# Altium schematic sheet ECGCircuit.SchDoc
size A3; SheetNumber: 4; SheetTotal: 4
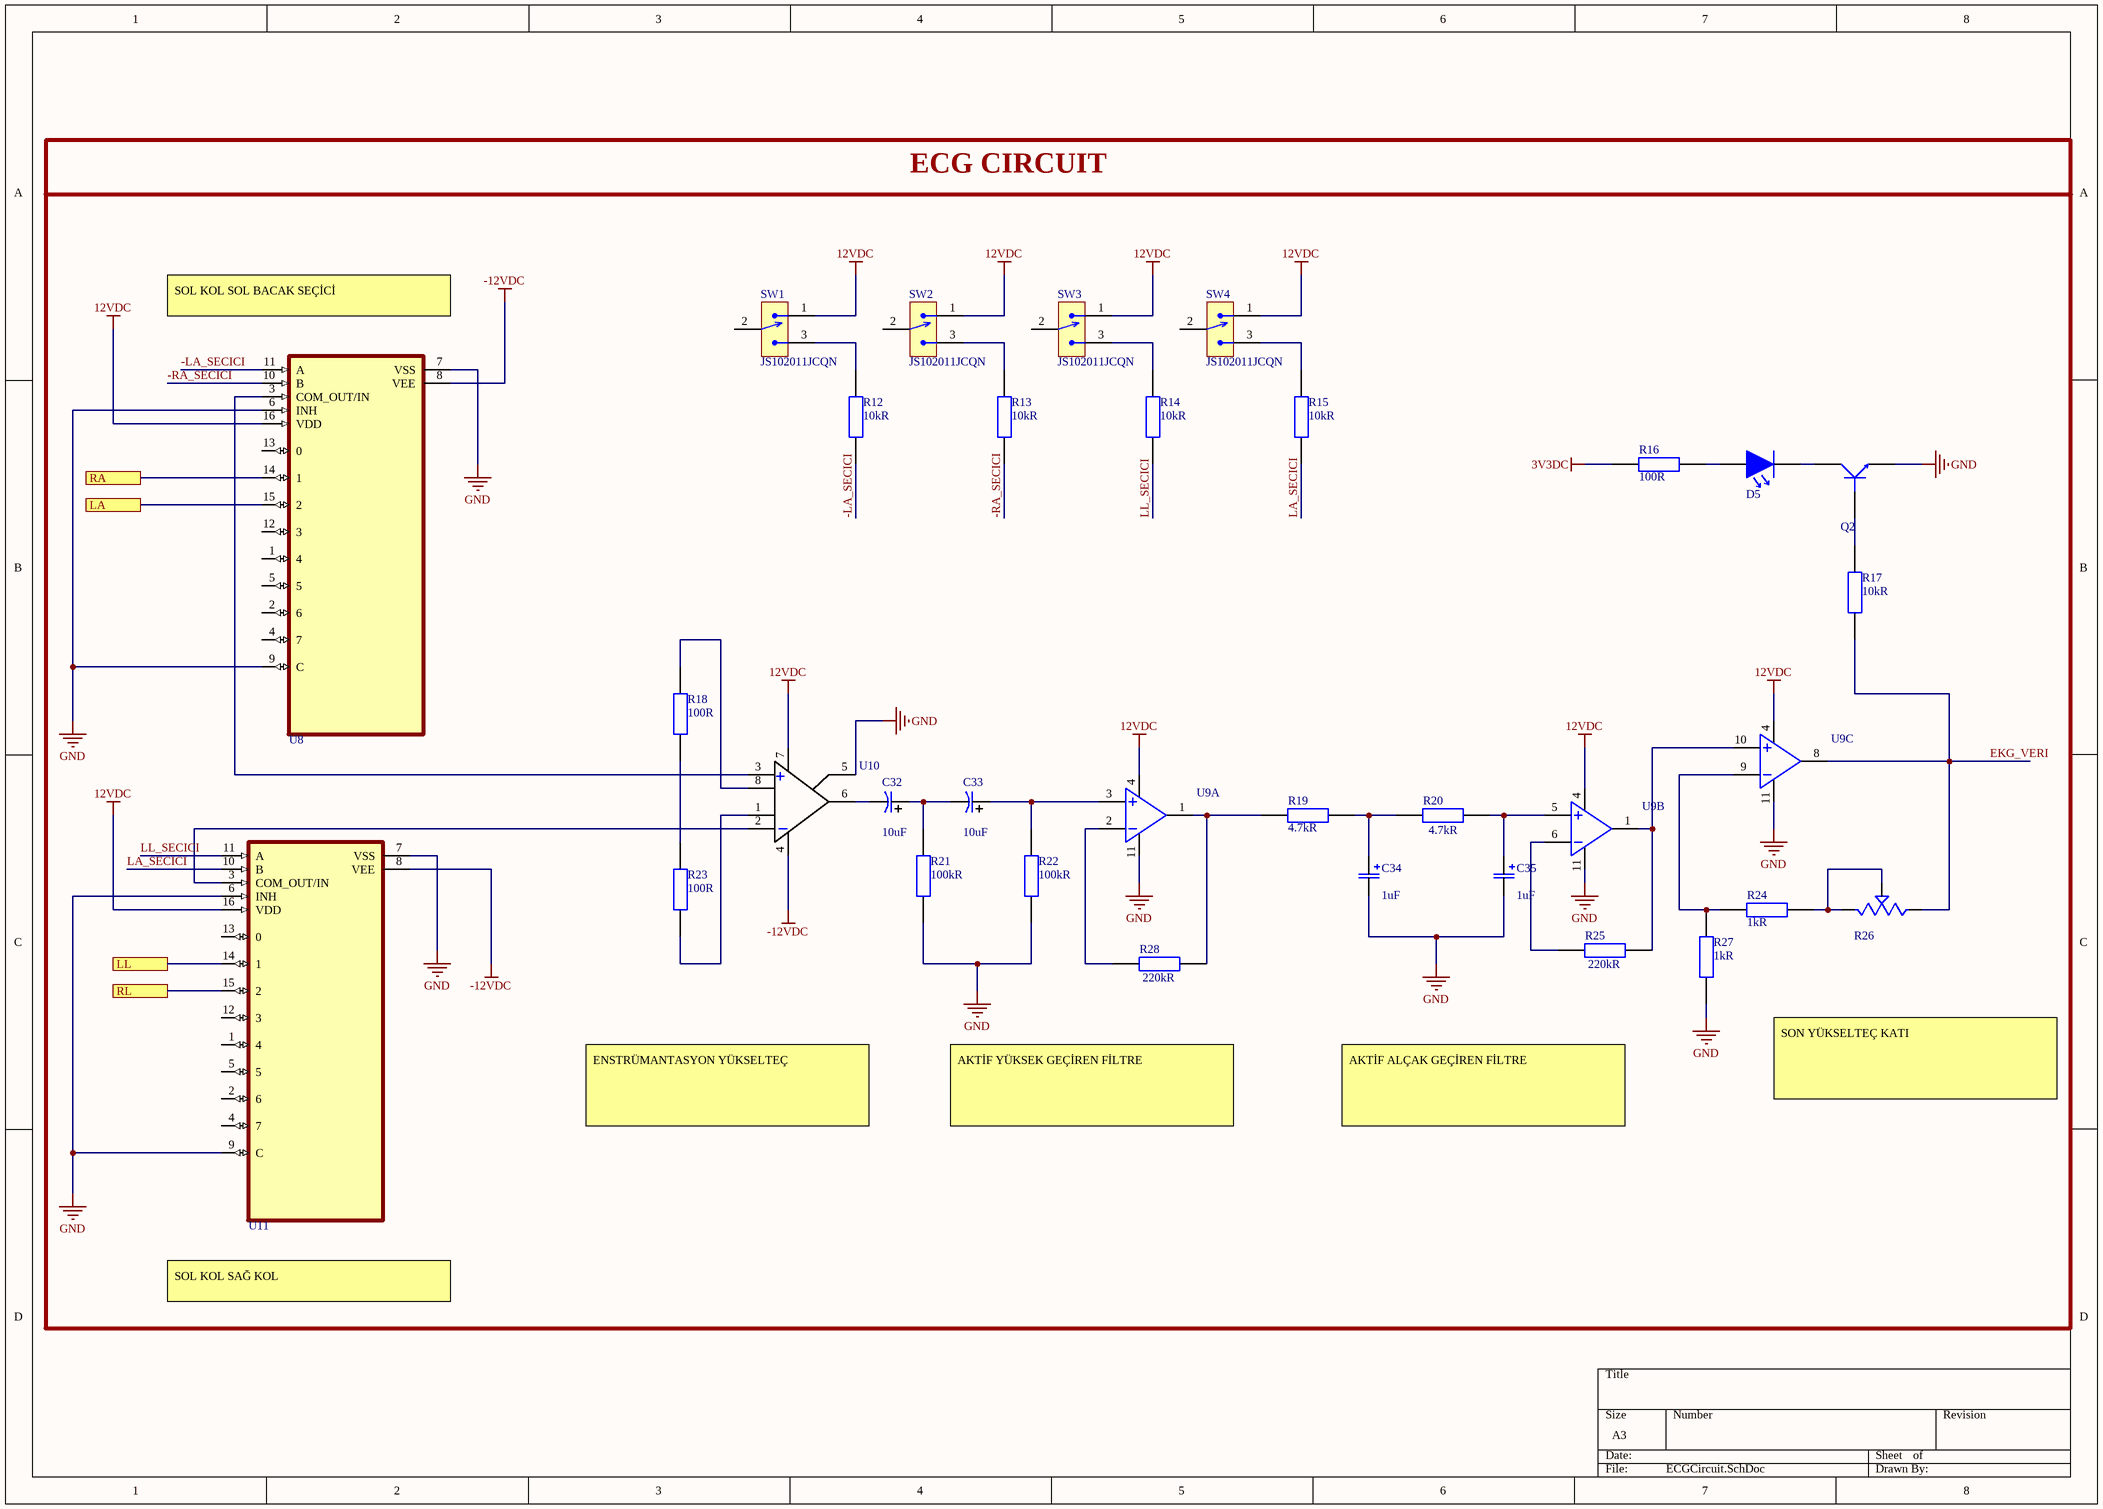
[diagram p0: ECGCircuit.SchDoc]

## Parts
C32  Capacitance: 10uF  [A700V_KEM]  (hidden comment: AP ALU 10uF)
C33  Capacitance: 10uF  [A700V_KEM]  (hidden comment: ALU 10uF)
C34  Capacitance: 1uF  [EXV-9B_KEM]  (hidden comment: CAP ALU 1uF)
C35  Capacitance: 1uF  [EXV-9B_KEM]  (hidden comment: CAP ALU 1uF)
D5  LH R974-LP-1  [LED_RED_0805]  (value not drawn)
Q2  MMBT3904-7-F  [SOT-23F]  (value not drawn)
R12  Resistance: 10kR  [RES_0603]  (hidden comment: RC0603FR-0710KL)
R13  Resistance: 10kR  [RES_0603]  (hidden comment: RC0603FR-0710KL)
R14  Resistance: 10kR  [RES_0603]  (hidden comment: RC0603FR-0710KL)
R15  Resistance: 10kR  [RES_0603]  (hidden comment: RC0603FR-0710KL)
R16  Resistance: 100R  [RES_0603]  (hidden comment: RC0603JR-07100RL)
R17  Resistance: 10kR  [RES_0603]  (hidden comment: RC0603FR-0710KL)
R18  Resistance: 100R  [RES_0603]  (hidden comment: RC0603JR-07100RL)
R19  Resistance: 4.7kR  [RES_0603]  (hidden comment: RC0603JR-074K7L)
R20  Resistance: 4.7kR  [RES_0603]  (hidden comment: RC0603JR-074K7L)
R21  Resistance: 100kR  [RES_0603]  (hidden comment: RES SMD 100KOHM 0.25% 1/10W 0603)
R22  Resistance: 100kR  [RES_0603]  (hidden comment: RES SMD 100KOHM 0.25% 1/10W 0603)
R23  Resistance: 100R  [RES_0603]  (hidden comment: RC0603JR-07100RL)
R24  Resistance: 1kR  [RES_0603]  (hidden comment: RC0603FR-0710KL)
R25  Resistance: 220kR  [RES_0603]  (hidden comment: RC0603JR-07220KL)
R26  TRIMMER, 12 TURN 50K  [3266W-1-503LF]  (value not drawn)
R27  Resistance: 1kR  [RES_0603]  (hidden comment: RC0603FR-0710KL)
R28  Resistance: 220kR  [RES_0603]  (hidden comment: RC0603JR-07220KL)
SW1  JS102011JCQN  [JS102011JCQN]
SW2  JS102011JCQN  [JS102011JCQN]
SW3  JS102011JCQN  [JS102011JCQN]
SW4  JS102011JCQN  [JS102011JCQN]
U8  CD4051BM  [SOİC16]  (value not drawn)
U9  IC OPAMP GP 1.3MHZ 14DIP  [SOIC14]  (value not drawn)  (parts A,B,C of 4)
U10  AD620BRZ-R7  [SOIC8]  (value not drawn)
U11  CD4051BM  [SOİC16]  (value not drawn)

## Blocks framed on the sheet
ECG CIRCUIT: C32-C35 D5 Q2 R12-R28 SW1-SW4 U8-U11

## Ports
LA, LL, RA, RL

## Nets
3V3DC: R16.2
12VDC: SW1.1 SW2.1 SW3.1 SW4.1 U8.16(VDD) U9.4 U10.7 U11.16(VDD)
-12VDC: U8.8(VEE) U10.4 U11.8(VEE)
GND: C34.2 C35.2 Q2.2(E) R21.1 R22.1 R27.1 U8.6(INH) U8.7(VSS) U8.9(C) U9.11 U10.5 U11.6(INH) U11.7(VSS) U11.9(C)
-LA_SECICI: R12.1 U8.11(A)
-RA_SECICI: R13.1 U8.10(B)
EKG_VERI: R17.1 R26.1(CCW) U9.8
LA: U8.15(2) ; port LA
LA_SECICI: R15.1 U11.10(B)
LL: U11.14(1) ; port LL
LL_SECICI: R14.1 U11.11(A)
RA: U8.14(1) ; port RA
RL: U11.15(2) ; port RL
NetC32_1: C32.1 C33.2 R21.2
NetC32_2: C32.2 U10.6
NetC33_1: C33.1 R22.2 U9.3
NetC34_1: C34.1 R19.2 R20.1
NetC35_1: C35.1 R20.2 U9.5
NetD5_1: D5.1 Q2.3(C)
NetD5_2: D5.2 R16.1
NetQ2_1: Q2.1(B) R17.2
NetR12_2: R12.2 SW1.3
NetR13_2: R13.2 SW2.3
NetR14_2: R14.2 SW3.3
NetR15_2: R15.2 SW4.3
NetR18_1: R18.1 R23.2
NetR18_2: R18.2 U10.8
NetR19_1: R19.1 R28.2 U9.1
NetR23_1: R23.1 U10.1
NetR24_1: R24.1 R27.2 U9.9
NetR24_2: R24.2 R26.2(WIPER) R26.3(CW)
NetR25_1: R25.1 U9.6
NetR25_2: R25.2 U9.1 U9.10
NetR28_1: R28.1 U9.2
NetU8_3: U8.3(COM_OUT/IN) U10.3
NetU10_2: U10.2 U11.3(COM_OUT/IN)

Not connected (* = marked no-connect by the designer): SW1 2; SW2 2; SW3 2; SW4 2; U8 1(4) 2(6) 4(7) 5 12(3) 13(0); U11 1(4) 2(6) 4(7) 5 12(3) 13(0)

## Notes on the sheet
- SOL KOL SOL BACAK SEÇİCİ
- ENSTRÜMANTASYON YÜKSELTEÇ
- AKTİF YÜKSEK GEÇİREN FİLTRE
- AKTİF ALÇAK GEÇİREN FİLTRE
- SON YÜKSELTEÇ KATI
- SOL KOL SAĞ KOL

## Library data of the parts
C32 C33 = CAP ALU 10uF: CAP ALUM POLY 10UF 20% 12.5V SMD; Manufacturer: KEMET; Manufacturer Part Number: A700V106M12RATE040; Ripple Current: 2.6A; ESR (Equivalent Series Resistance): 40mR; Resistance: 0.04R; Leakage Current: 70.5uA; Supplier 1: Digi-Key; RoHS: Yes; Category: Polymer Capacitors; Stock 1: 1836; Pricing 1: 1=2,35000, 10=1,89800, 50=1,65600, 100=1,44900, 500=1,10400 (USD); Mount: Surface Mount; Case/Package: 2917; Case Code (Metric): 7343; Case Code (Imperial): 2917; Min Operating Temperature: -55°C; Max Operating Temperature: 125°C; Package Quantity: 1; Voltage Rating: 12.5V; Tolerance: 20%; Packaging: Tape and Reel; Voltage Rating (DC): 12.5V; Termination: SMD/SMT; Series: AO-Cap A700; Length: 7.3mm; Width: 0.169inch; Height: 2mm; Height - Seated (Max): 0.079inch; Depth: 4.3mm; Radiation Hardening: No; RoHS Compliant: Yes; ComponentLink1URL: https://datasheet.ciiva.com/18192/getdatasheetpartid-711731-18192331.pdf?src-supplier=Verical; ComponentLink1Description: https://datasheet.ciiva.com/18192/getdatasheetpartid-711731-18192331.pdf?src-supplier=Verical; Supplier Part Number 1: 399-5293-1-ND
C34 C35 = CAP ALU 1uF: KEMET - EXV105M050A9BAA - CAP, 1µF, 50V, RADIAL, SMD; Tolerance: 20%; Ripple Current: 42mA; Ripple Current (AC): 60mA; Polarity: Polar; Impedance: 5R; Life (Hours): 3000Hour; Supplier 1: Digi-Key; Manufacturer: KEMET; Manufacturer Part Number: EXV105M050A9BAA; RoHS: Yes; Category: Aluminum Electrolytic Capacitors; Stock 1: 8489; Pricing 1: 1=0,41000, 10=0,28400, 50=0,19880, 100=0,17040, 500=0,12782, 1000=0,10794 (USD); Mount: Surface Mount; Case/Package: Radial; Min Operating Temperature: -40°C; Max Operating Temperature: 105°C; Voltage Rating: 50V; Packaging: Cut Tape; Package Quantity: 2000; Voltage Rating (DC): 50V; Series: EXV; Construction: Cylindrical; Diameter: 4mm; Height: 5.4mm; Height - Seated (Max): 0.222inch; REACH SVHC: No SVHC; RoHS Compliant: Yes; ComponentLink1URL: https://datasheet.ciiva.com/8032/1500293-8032447.pdf?src-supplier=Element14; ComponentLink1Description: https://datasheet.ciiva.com/8032/1500293-8032447.pdf?src-supplier=Element14; Supplier Part Number 1: 399-11442-1-ND
D5 = LED RED 0805: LED Uni-Color Hyper Red 660nm 2-Pin Chip 0805(2012Metric) T/R; Manufacturer: Osram Opto; Lens Color: White; Forward Voltage: 1.8V; Lens Style: Diffused,Flat,Colorless; Luminous Intensity: 71mcd; Viewing Angle: 160°; Forward Current: 30mA; Dominant Wavelength: 645nm; Number of Elements: 1; Test Current: 20mA; Reverse Voltage: 5V; Lens Transparency: Diffused; Luminous Flux: 0.17lm; Lens Size: 1.25mm; Designed by: TALAT; Supplier 1: Digi-Key; Manufacturer Part Number: LH R974-LP-1; RoHS: Yes; Category: LEDs; Stock 1: 35632; Pricing 1: 1=0,26000, 10=0,13900, 100=0,06480, 500=0,05978, 1000=0,04683, 2000=0,04584 (USD); Mount: Surface Mount; Case/Package: 0805; Number of Pins: 2; Color: Red; Case Code (Imperial): 0805; Case Code (Metric): 2012; Min Operating Temperature: -30°C; Max Operating Temperature: 85°C; Packaging: Tape and Reel; Illumination Color: Red; Package Quantity: 1; Series: CHipLED; Length: 2.1mm; Width: 1.25mm; Depth: 1.35mm; Radiation Hardening: No; RoHS Compliant: Yes; ComponentLink1URL: http://www.jameco.com/Jameco/Products/ProdDS/2085634.pdf?src-supplier=Jameco; ComponentLink1Description: http://www.jameco.com/Jameco/Products/ProdDS/2085634.pdf?src-supplier=Jameco; ComponentLink2URL: http://components.arrow.com/part/dataview/0323_01825492?src-supplier=Arrow+Europe; ComponentLink2Description: http://components.arrow.com/part/dataview/0323_01825492?src-supplier=Arrow+Europe; ComponentLink3URL: https://dammedia.osram.info/media/resource/hires/osram-dam-2493888/LH%20R974.pdf?src-supplier=Digi-Key; ComponentLink3Description: https://dammedia.osram.info/media/resource/hires/osram-dam-2493888/LH%20R974.pdf?src-supplier=Digi-Key; ComponentLink4URL: http://www.mouser.com/ds/2/311/LH%20R974%20-%20CHIPLED%200805-318659.pdf?src-supplier=Mouser; ComponentLink4Description: http://www.mouser.com/ds/2/311/LH%20R974%20-%20CHIPLED%200805-318659.pdf?src-supplier=Mouser; ComponentLink5URL: https://www.verical.com/server-webapp/html/getDatasheet?partID=258950&src-supplier=Verical; ComponentLink5Description: https://www.verical.com/server-webapp/html/getDatasheet?partID=258950&src-supplier=Verical; ComponentLink6URL: http://components.arrow.com/part/dataview/41971690S1077610N9133?src-supplier=Arrow+Electronics; ComponentLink6Description: http://components.arrow.com/part/dataview/41971690S1077610N9133?src-supplier=Arrow+Electronics; ComponentLink7URL: http://components.arrow.com/part/dataview/41971690S6190115N2128?src-supplier=Arrow+Electronics; ComponentLink7Description: http://components.arrow.com/part/dataview/41971690S6190115N2128?src-supplier=Arrow+Electronics; Supplier Part Number 1: 475-1415-1-ND
Q2 = MMBT3904-7-F: Transistor General Purpose BJT NPN 40 Volt 0.2A Automotive 3-Pin SOT-23; Manufacturer: Diodes Zetex; Designed by: TALAT; Max Power Dissipation: 300mW; Collector Emitter Voltage (VCEO): 40V; Max Collector Current: 200mA; Collector Base Voltage (VCBO): 60V; Frequency: 300MHz; hFE Min: 100; Number of Elements: 1; Emitter Base Voltage (VEBO): 6V; Collector Emitter Saturation Voltage: 300mV; Power Dissipation: 350mW; Element Configuration: Single; Supplier 1: Digi-Key; Manufacturer Part Number: MMBT3904-7-F; RoHS: Yes; Category: BJTs; Stock 1: 2393281; Pricing 1: 1=0,12000, 10=0,08600, 25=0,08280, 100=0,04660, 500=0,03664, 1000=0,02544 (USD); Mount: Surface Mount; Case/Package: SOT-23; Number of Pins: 3; Weight: 0.000282oz; Contact Plating: Tin,Matte; Min Operating Temperature: -55°C; Max Operating Temperature: 150°C; Polarity: NPN; Packaging: Tape and Reel; Package Quantity: 3000; Transition Frequency: 300MHz; Collector Emitter Breakdown Voltage: 40V; Max Breakdown Voltage: 40V; Continuous Collector Current: 200mA; Max Frequency: 300MHz; Gain Bandwidth Product: 300MHz; Series: -; Collector-emitter Voltage-Max: 300mV; Voltage Rating (DC): 40V; Length: 3.05mm; Width: 1.4mm; Height: 1mm; Radiation Hardening: No; REACH SVHC: No SVHC; Lead Free: Lead Free; RoHS Compliant: Yes; ComponentLink1URL: https://datasheet.ciiva.com/11201/ds30036-11201778.pdf?src-supplier=Avnet; ComponentLink1Description: https://datasheet.ciiva.com/11201/ds30036-11201778.pdf?src-supplier=Avnet; ComponentLink2URL: https://datasheet.ciiva.com/15138/getdatasheetpartid-53265-15138780.pdf?src-supplier=Verical; ComponentLink2Description: https://datasheet.ciiva.com/15138/getdatasheetpartid-53265-15138780.pdf?src-supplier=Verical; ComponentLink3URL: https://datasheet.ciiva.com/6361/ds30036-6361254.pdf?src-supplier=Digi-Key; ComponentLink3Description: https://datasheet.ciiva.com/6361/ds30036-6361254.pdf?src-supplier=Digi-Key; ComponentLink4URL: https://datasheet.ciiva.com/22711/1915516-22711750.pdf?src-supplier=Element14; ComponentLink4Description: https://datasheet.ciiva.com/22711/1915516-22711750.pdf?src-supplier=Element14; ComponentLink5URL: https://datasheet.ciiva.com/11198/ds30036-11198999.pdf?src-supplier=Avnet; ComponentLink5Description: https://datasheet.ciiva.com/11198/ds30036-11198999.pdf?src-supplier=Avnet; ComponentLink6URL: https://datasheet.ciiva.com/6361/ds30036-6361256.pdf?src-supplier=Digi-Key; ComponentLink6Description: https://datasheet.ciiva.com/6361/ds30036-6361256.pdf?src-supplier=Digi-Key; Supplier Part Number 1: MMBT3904-FDIDKR-ND
R12-R15 R17 = RES 10K OHM 0603: RES 10K %1 OHM 0603 SMD; Manufacturer: Yageo; Designed by: TALAT; Tolerance: 1%; Temperature Coefficient: 100ppm/°C; Voltage Rating (DC): 50V; Power Rating: 100mW; Voltage Rating: 75V; Supplier 1: Digi-Key; Manufacturer Part Number: RC0603FR-0710KL; RoHS: Yes; Category: Chip SMD Resistors; Stock 1: 28304153; Pricing 1: 1=0,10000, 10=0,02400, 100=0,00970, 1000=0,00436, 2500=0,00378 (USD); Case/Package: 0603; Number of Pins: 2; Case Code (Imperial): 0603; Case Code (Metric): 1608; Weight: 7.1E-05oz; Size Code: 0603; Min Operating Temperature: -55°C; Max Operating Temperature: 155°C; Resistor Type: Thick Film; Packaging: Tape and Reel; Termination: SMD/SMT; Features: Moisture Resistant; Series: RC; Max Power Dissipation: 100mW; Number of Terminations: 2; Resistance Tolerance: 1%; Construction: Rectangular; Length: 1.6mm; Width: 0.8mm; Height: 0.45mm; Depth: 0.8mm; Lead Pitch: 0.3mm; REACH SVHC: Unknown; Lead Free: Lead Free; Military Standard: Not; RoHS Compliant: Yes; ComponentLink1URL: https://datasheet.ciiva.com/7660/38590-7660789.pdf?src-supplier=Element14; ComponentLink1Description: https://datasheet.ciiva.com/7660/38590-7660789.pdf?src-supplier=Element14; ComponentLink2URL: https://datasheet.ciiva.com/7983/443971-7983596.pdf?src-supplier=Element14; ComponentLink2Description: https://datasheet.ciiva.com/7983/443971-7983596.pdf?src-supplier=Element14; ComponentLink3URL: https://datasheet.ciiva.com/22747/443971-22747519.pdf?src-supplier=Element14; ComponentLink3Description: https://datasheet.ciiva.com/22747/443971-22747519.pdf?src-supplier=Element14; ComponentLink4URL: https://datasheet.ciiva.com/46440/1868787-46440891.pdf?src-supplier=Element14; ComponentLink4Description: https://datasheet.ciiva.com/46440/1868787-46440891.pdf?src-supplier=Element14; ComponentLink5URL: https://datasheet.ciiva.com/7746/1738695-7746239.pdf?src-supplier=Element14; ComponentLink5Description: https://datasheet.ciiva.com/7746/1738695-7746239.pdf?src-supplier=Element14; ComponentLink6URL: https://datasheet.ciiva.com/15189/getdatasheetpartid-409289-15189591.pdf?src-supplier=Verical; ComponentLink6Description: https://datasheet.ciiva.com/15189/getdatasheetpartid-409289-15189591.pdf?src-supplier=Verical; Supplier Part Number 1: 311-10.0KHRCT-ND
R16 R18 R23 = RES 100 OHM 0603: RES 100 %5 OHM 0603 SMD; Manufacturer: Yageo; Designed by: TALAT; Tolerance: 5%; Temperature Coefficient: 100ppm/°C; Voltage Rating (DC): 50V; Power Rating: 100mW; Supplier 1: Digi-Key; Manufacturer Part Number: RC0603JR-07100RL; RoHS: Yes; Category: Chip SMD Resistors; Stock 1: 4334796; Pricing 1: 1=0,10000, 10=0,01900, 100=0,00770, 1000=0,00344, 2500=0,00298 (USD); Case/Package: 0603; Number of Pins: 2; Contact Plating: Tin,Matte; Case Code (Imperial): 0603; Case Code (Metric): 1608; Size Code: 0603; Min Operating Temperature: -55°C; Max Operating Temperature: 155°C; Resistor Type: Thick Film; Packaging: Tape and Reel; Voltage Rating: 50V; Termination: SMD/SMT; Features: Moisture Resistant; Series: RC; Max Power Dissipation: 100mW; Number of Terminations: 2; Construction: Rectangular; Resistance Tolerance: 5%; Length: 1.6mm; Width: 0.8mm; Depth: 0.8mm; Radiation Hardening: No; REACH SVHC: Unknown; Lead Free: Lead Free; Military Standard: Not; RoHS Compliant: Yes; ComponentLink1URL: https://datasheet.ciiva.com/15189/getdatasheetpartid-325207-15189846.pdf?src-supplier=Verical; ComponentLink1Description: https://datasheet.ciiva.com/15189/getdatasheetpartid-325207-15189846.pdf?src-supplier=Verical; ComponentLink2URL: https://datasheet.ciiva.com/8883/pyu-rc0603-51-rohs-l-4-8883047.pdf?src-supplier=Avnet; ComponentLink2Description: https://datasheet.ciiva.com/8883/pyu-rc0603-51-rohs-l-4-8883047.pdf?src-supplier=Avnet; ComponentLink3URL: https://datasheet.ciiva.com/7746/443971-7746425.pdf?src-supplier=Element14; ComponentLink3Description: https://datasheet.ciiva.com/7746/443971-7746425.pdf?src-supplier=Element14; ComponentLink4URL: https://datasheet.ciiva.com/7746/443971-7746426.pdf?src-supplier=Element14; ComponentLink4Description: https://datasheet.ciiva.com/7746/443971-7746426.pdf?src-supplier=Element14; Supplier Part Number 1: 311-100GRCT-ND
R19 R20 = RES 4K7 OHM 0603: RES 4K7 %5 OHM 0603 SMD; Manufacturer: Yageo; Tolerance: 5%; Temperature Coefficient: 100ppm/°C; Voltage Rating (DC): 50V; Power Rating: 100mW; Designed by: TALAT; Supplier 1: Digi-Key; Manufacturer Part Number: RC0603JR-074K7L; RoHS: Yes; Category: Chip SMD Resistors; Stock 1: 3901839; Pricing 1: 1=0,10000, 10=0,01900, 100=0,00770, 1000=0,00344, 2500=0,00298 (USD); Case/Package: 0603; Number of Pins: 2; Case Code (Imperial): 0603; Case Code (Metric): 1608; Size Code: 0603; Min Operating Temperature: -55°C; Max Operating Temperature: 155°C; Resistor Type: Thick Film; Packaging: Tape and Reel; Voltage Rating: 50V; Termination: SMD/SMT; Features: Moisture Resistant; Max Power Dissipation: 100mW; Number of Terminations: 2; Series: RC; Resistance Tolerance: 5%; Construction: Rectangular; Length: 1.6mm; Width: 0.8mm; Depth: 0.8mm; REACH SVHC: No SVHC; Lead Free: Lead Free; RoHS Compliant: Yes; Military Standard: Not; ComponentLink1URL: https://datasheet.ciiva.com/46412/443971-46412858.pdf?src-supplier=Element14; ComponentLink1Description: https://datasheet.ciiva.com/46412/443971-46412858.pdf?src-supplier=Element14; Supplier Part Number 1: 311-4.7KGRCT-ND
R21 R22 = RES 100K OHM 0603: Manufacturer: Yageo; Manufacturer Part Number: RT0603CRE07100KL; Max Power Dissipation: 100mW; Temperature Coefficient: 50ppm/°C; Voltage Rating (DC): 50V; Supplier 1: Digi-Key; RoHS: Yes; Category: Chip SMD Resistors; Stock 1: 2228; Pricing 1: 1=0,41000, 10=0,29400, 100=0,11760, 1000=0,05794, 2500=0,05368 (USD); Case/Package: 0603; Min Operating Temperature: -55°C; Max Operating Temperature: 125°C; Package Quantity: 5000; Packaging: Tape and Reel; Tolerance: 0.25%; Resistor Type: Thin Film; Number of Terminations: 2; Series: RT; Length: 0.063inch; Width: 0.031inch; Height: 0.022inch; Lead Free: Lead Free; RoHS Compliant: Yes; ComponentLink1URL: https://datasheet.ciiva.com/2586/pyu-rt-1-to-0-05-rohs-l-5-2586117.pdf?src-supplier=Digi-Key; ComponentLink1Description: https://datasheet.ciiva.com/2586/pyu-rt-1-to-0-05-rohs-l-5-2586117.pdf?src-supplier=Digi-Key; Supplier Part Number 1: YAG4793CT-ND
R24 R27 = RES 1K OHM 0603: RES 1K %1 OHM 0603 SMD; Manufacturer: Yageo; Manufacturer Part Number: RC0603JR-071KL; Designed by: TALAT; Tolerance: 5%; Temperature Coefficient: 100ppm/°C; Voltage Rating (DC): 50V; Power Rating: 100mW; Body Length: 1.6mm; Supplier 1: Digi-Key; RoHS: Yes; Category: Chip SMD Resistors; Stock 1: 5112056; Pricing 1: 1=0,10000, 10=0,01900, 100=0,00770, 1000=0,00344, 2500=0,00298 (USD); Case/Package: 0603; Number of Pins: 2; Contact Plating: Tin,Matte; Case Code (Imperial): 0603; Case Code (Metric): 1608; Size Code: 0603; Min Operating Temperature: -55°C; Max Operating Temperature: 155°C; Resistor Type: Thick Film; Packaging: Tape and Reel; Package Quantity: 5000; Voltage Rating: 50V; Termination: SMD/SMT; Series: RC; Resistance Tolerance: 5%; Construction: Rectangular; Length: 1.6mm; Width: 0.8mm; Height: 0.45mm; Depth: 0.8mm; Radiation Hardening: No; REACH SVHC: Unknown; Lead Free: Lead Free; Military Standard: Not; RoHS Compliant: Yes; ComponentLink1URL: https://datasheet.ciiva.com/8883/pyu-rc0603-51-rohs-l-4-8883051.pdf?src-supplier=Avnet; ComponentLink1Description: https://datasheet.ciiva.com/8883/pyu-rc0603-51-rohs-l-4-8883051.pdf?src-supplier=Avnet; ComponentLink2URL: https://datasheet.ciiva.com/7746/443971-7746461.pdf?src-supplier=Element14; ComponentLink2Description: https://datasheet.ciiva.com/7746/443971-7746461.pdf?src-supplier=Element14; ComponentLink3URL: https://datasheet.ciiva.com/22747/443971-22747533.pdf?src-supplier=Element14; ComponentLink3Description: https://datasheet.ciiva.com/22747/443971-22747533.pdf?src-supplier=Element14; ComponentLink4URL: https://datasheet.ciiva.com/7746/443971-7746462.pdf?src-supplier=Element14; ComponentLink4Description: https://datasheet.ciiva.com/7746/443971-7746462.pdf?src-supplier=Element14; Supplier Part Number 1: 311-1.0KGRCT-ND
R25 R28 = RES 220K OHM 0603: RES 220K %5 OHM 0603 SMD; Manufacturer: Yageo; Deisgned by: TALAT; Tolerance: 5%; Temperature Coefficient: 100ppm/°C; Voltage Rating (DC): 50V; Power Rating: 100mW; Supplier 1: Digi-Key; Manufacturer Part Number: RC0603JR-07220KL; RoHS: Yes; Category: Chip SMD Resistors; Stock 1: 558053; Pricing 1: 1=0,10000, 10=0,01900, 100=0,00770, 1000=0,00344, 2500=0,00298 (USD); Case/Package: 0603; Number of Pins: 2; Case Code (Imperial): 0603; Case Code (Metric): 1608; Size Code: 0603; Min Operating Temperature: -55°C; Max Operating Temperature: 155°C; Resistor Type: Thick Film; Packaging: Tape and Reel; Voltage Rating: 50V; Package Quantity: 1; Termination: SMD/SMT; Number of Terminations: 2; Max Power Dissipation: 100mW; Features: Moisture Resistant; Series: RC; Construction: Rectangular; Resistance Tolerance: 5%; Length: 1.6mm; Width: 0.031inch; Height: 0.022inch; Depth: 0.8mm; REACH SVHC: No SVHC; Lead Free: Lead Free; RoHS Compliant: Yes; Military Standard: Not; ComponentLink1URL: https://datasheet.ciiva.com/2452/pyu-r-int-thick-7-2452923.pdf?src-supplier=Digi-Key; ComponentLink1Description: https://datasheet.ciiva.com/2452/pyu-r-int-thick-7-2452923.pdf?src-supplier=Digi-Key; ComponentLink2URL: https://datasheet.ciiva.com/2452/pyu-r-int-thick-7-2452924.pdf?src-supplier=Digi-Key; ComponentLink2Description: https://datasheet.ciiva.com/2452/pyu-r-int-thick-7-2452924.pdf?src-supplier=Digi-Key; ComponentLink3URL: https://datasheet.ciiva.com/2452/pyu-r-int-thick-7-2452925.pdf?src-supplier=Digi-Key; ComponentLink3Description: https://datasheet.ciiva.com/2452/pyu-r-int-thick-7-2452925.pdf?src-supplier=Digi-Key; Supplier Part Number 1: 311-220KGRCT-ND
R26 = Res POT 50K: Manufacturer: Bourns; Tolerance: 10%; Number of Turns: 12; Resistance: 50kR; Power Rating: 250mW; Voltage Rating: 300V; Temperature Coefficient: 100ppm/°C; Lead Diameter: 0.5mm; Pitch: 2.54mm; Designed by: TALAT; Supplier 1: Digi-Key; Manufacturer Part Number: 3266W-1-503LF; RoHS: Yes; Category: Variable Resistors and Potentiometers; Stock 1: 3085; Pricing 1: 1=4,16000, 10=3,64000, 25=3,25000, 50=3,05500, 100=2,99000, 250=2,86000, 500=2,34000, 1000=2,01500, 5000=1,82000 (USD); Mount: Through Hole,PCB; Weight: 0.015oz; Color: Blue; Contact Plating: Tin,Matte; Min Operating Temperature: -55°C; Max Operating Temperature: 150°C; Package Quantity: 100; Packaging: Rail/Tube; Termination: Pin; Resistor Type: Cermet; Voltage Rating (DC): 300V; Taper: Linear; Max Power Dissipation: 250mW; Series: 3266; Technology: CERMET; Resistance Tolerance: 10%; Length: 6.71mm; Width: 4.5mm; Height: 0.27inch; Depth: 4.5mm; Radiation Hardening: No; REACH SVHC: No SVHC; Lead Free: Lead Free; Military Standard: Not; RoHS Compliant: Yes; ComponentLink1URL: https://datasheet.ciiva.com/11831/0900766b806d6d20-11831181.pdf?src-supplier=RSComponents; ComponentLink1Description: https://datasheet.ciiva.com/11831/0900766b806d6d20-11831181.pdf?src-supplier=RSComponents; ComponentLink2URL: https://datasheet.ciiva.com/19482/696458-19482125.pdf?src-supplier=Jameco; ComponentLink2Description: https://datasheet.ciiva.com/19482/696458-19482125.pdf?src-supplier=Jameco; ComponentLink3URL: https://datasheet.ciiva.com/29122/447254-da-01-en-trimmer-tht-3266w-1-503lf-50k-0-25w-29122338.pdf?src-supplier=Conrad; ComponentLink3Description: https://datasheet.ciiva.com/29122/447254-da-01-en-trimmer-tht-3266w-1-503lf-50k-0-25w-29122338.pdf?src-supplier=Conrad; ComponentLink4URL: https://datasheet.ciiva.com/26913/3266w-1-503lf-26913868.pdf?src-supplier=IIIC; ComponentLink4Description: https://datasheet.ciiva.com/26913/3266w-1-503lf-26913868.pdf?src-supplier=IIIC; ComponentLink5URL: https://datasheet.ciiva.com/14173/es3266w-dat-e-14173065.pdf?src-supplier=Distrelec; ComponentLink5Description: https://datasheet.ciiva.com/14173/es3266w-dat-e-14173065.pdf?src-supplier=Distrelec; ComponentLink6URL: https://datasheet.ciiva.com/20163/68-0200e-20163977.pdf?src-supplier=Rapid+Electronics; ComponentLink6Description: https://datasheet.ciiva.com/20163/68-0200e-20163977.pdf?src-supplier=Rapid+Electronics; ComponentLink7URL: https://datasheet.ciiva.com/16818/3266-16818986.pdf?src-supplier=Avnet+Europe; ComponentLink7Description: https://datasheet.ciiva.com/16818/3266-16818986.pdf?src-supplier=Avnet+Europe; ComponentLink8URL: https://datasheet.ciiva.com/1131/1719388-1131116.pdf?src-supplier=Element14; ComponentLink8Description: https://datasheet.ciiva.com/1131/1719388-1131116.pdf?src-supplier=Element14; ComponentLink9URL: https://datasheet.ciiva.com/2156/3266-2156991.pdf?src-supplier=Digi-Key; ComponentLink9Description: https://datasheet.ciiva.com/2156/3266-2156991.pdf?src-supplier=Digi-Key; Supplier Part Number 1: 3266W-503LF-ND
U8 U11 = CD4051BM: Analog Multiplexer Single 8:1 16-Pin SOIC Tube; Manufacturer: Texas Instruments; Bandwidth: 20MHz; Propagation Delay: 60ns; Min Supply Voltage: 3V; Max Supply Voltage: 20V; Number of Outputs: 1; Operating Supply Voltage: 18V; Number of Inputs: 8; Min Dual Supply Voltage: 2.5V; Max Dual Supply Voltage: 9V; On-State Resistance: 240R; Operating Supply Current: 80nA; Logic Function: Multiplexer,Demultiplexer; Supply Type: Single,Dual; Turn-On Delay Time: 720ns; Turn-Off Delay Time: 450ns; Dual Supply Voltage: 5V; Max Power Dissipation: 700mW; Supplier 1: Digi-Key; Manufacturer Part Number: CD4051BM; RoHS: No; Category: Decoders and Multiplexers; Pricing 1: 1=0,63000, 10=0,53700, 25=0,50080, 100=0,40070, 250=0,37208, 500=0,31482, 1000=0,24327, 2500=0,23625 (USD); Mount: Surface Mount; Case/Package: SOIC; Number of Pins: 16; Weight: 0.004998oz; Contact Plating: Gold; Min Operating Temperature: -55°C; Max Operating Temperature: 125°C; Packaging: Rail/Tube; Package Quantity: 40; Number of Channels: 1; Number of Bits: 8; Number of Circuits: 1; Length: 9.9mm; Width: 3.91mm; Height: 1.58mm; Radiation Hardening: No; Lead Free: Lead Free; REACH SVHC: No SVHC; ComponentLink1URL: https://datasheet.ciiva.com/27050/894438-27050684.pdf?src-supplier=Jameco; ComponentLink1Description: https://datasheet.ciiva.com/27050/894438-27050684.pdf?src-supplier=Jameco; ComponentLink2URL: https://datasheet.ciiva.com/15126/getdatasheetpartid-37280-15126876.pdf?src-supplier=Verical; ComponentLink2Description: https://datasheet.ciiva.com/15126/getdatasheetpartid-37280-15126876.pdf?src-supplier=Verical; ComponentLink3URL: https://datasheet.ciiva.com/41461/001187354-da-01-en-ic-mux-demux-8x1-cd-cd4051bm-soic-16-tid-41461592.pdf?src-supplier=Conrad; ComponentLink3Description: https://datasheet.ciiva.com/41461/001187354-da-01-en-ic-mux-demux-8x1-cd-cd4051bm-soic-16-tid-41461592.pdf?src-supplier=Conrad; ComponentLink4URL: https://datasheet.ciiva.com/1671/cd4051b-1671202.pdf?src-supplier=Digi-Key; ComponentLink4Description: https://datasheet.ciiva.com/1671/cd4051b-1671202.pdf?src-supplier=Digi-Key; ComponentLink5URL: https://datasheet.ciiva.com/1171/1633807-1171292.pdf?src-supplier=Element14; ComponentLink5Description: https://datasheet.ciiva.com/1171/1633807-1171292.pdf?src-supplier=Element14; Supplier Part Number 1: 296-25947-5-ND
U9 = OPALM324N: Manufacturer: STMicroelectronics; Manufacturer Part Number: LM324N; Number of Circuits: 4; Min Supply Voltage: 3V; Max Supply Voltage: 30V; Voltage Gain: 100dB; Min Dual Supply Voltage: 1.5V; Max Dual Supply Voltage: 15V; Slew Rate: 0.4V/µs; Common Mode Rejection Ratio: 70dB; Input Offset Voltage (Vos): 7mV; Input Bias Current: 150nA; Bandwidth: 1MHz; Output Current: 40mA; Operating Supply Current: 1.5mA; Output Current per Channel: 70mA; Nominal Supply Current: 1.2mA; Amplifier Type: GENERAL PURPOSE; Dual Supply Voltage: 9V; Designed by: Talat; Supplier 1: Digi-Key; RoHS: Yes; Category: Amplifiers - Op Amps, Buffer, Instrumentation; Mount: Through Hole; Case/Package: DIP; Number of Pins: 14; Weight: 0.01lb; Min Operating Temperature: 0°C; Max Operating Temperature: 70°C; Gain Bandwidth Product: 1.3MHz; Packaging: Rail/Tube; Number of Channels: 4; Operating Supply Voltage: 15V; Package Quantity: 25; Number of Elements: 4; Unity Gain Bandwidth Product: 1.3MHz; Number of Amplifiers: 4; Supply Current: 1.2mA; Technology: BIPOLAR; Gain: 100dB; Input Offset Voltage-Max: 7mV; Slew Rate-Nom: 0.4V/µs; Length: 20mm; Width: 7.1mm; Height: 5.1mm; Radiation Hardening: No; Lead Free: Lead Free; RoHS Compliant: Yes; REACH SVHC: No SVHC; ComponentLink1URL: https://datasheet.ciiva.com/29304/151814-da-01-en-ic-lm-324-n-dip14-stm-29304955.pdf?src-supplier=Conrad; ComponentLink1Description: https://datasheet.ciiva.com/29304/151814-da-01-en-ic-lm-324-n-dip14-stm-29304955.pdf?src-supplier=Conrad; ComponentLink2URL: https://datasheet.ciiva.com/29306/155592-da-01-en-op-verst-lm324n-stm-29306814.pdf?src-supplier=Conrad; ComponentLink2Description: https://datasheet.ciiva.com/29306/155592-da-01-en-op-verst-lm324n-stm-29306814.pdf?src-supplier=Conrad; ComponentLink3URL: https://datasheet.ciiva.com/29305/175838-da-01-en-ic-lm-324-n-dip14-stm-29305779.pdf?src-supplier=Conrad; ComponentLink3Description: https://datasheet.ciiva.com/29305/175838-da-01-en-ic-lm-324-n-dip14-stm-29305779.pdf?src-supplier=Conrad; ComponentLink4URL: https://datasheet.ciiva.com/1796/cd00000457-1796611.pdf?src-supplier=Digi-Key; ComponentLink4Description: https://datasheet.ciiva.com/1796/cd00000457-1796611.pdf?src-supplier=Digi-Key; ComponentLink5URL: https://datasheet.ciiva.com/27746/82-0228-27746348.pdf?src-supplier=Rapid+Electronics; ComponentLink5Description: https://datasheet.ciiva.com/27746/82-0228-27746348.pdf?src-supplier=Rapid+Electronics; ComponentLink6URL: https://datasheet.ciiva.com/8008/1834360-8008491.pdf?src-supplier=Element14; ComponentLink6Description: https://datasheet.ciiva.com/8008/1834360-8008491.pdf?src-supplier=Element14; Supplier Part Number 1: 497-1581-5-ND
U10 = AD620: SP Amp INSTR Amp Single ±18V 8-Pin SOIC N T/R; Manufacturer: Analog Devices; Min Dual Supply Voltage: 2.3V; -3db Bandwidth: 1MHz; Common Mode Rejection Ratio: 93dB; Number of Channels: 1; Min Supply Voltage: 4.6V; Slew Rate: 1.2V/µs; Max Power Dissipation: 650mW; Input Bias Current: 1nA; Input Offset Voltage (Vos): 30mV; Operating Supply Current: 1.3mA; Output Current per Channel: 18mA; Input Resistance: 10GR; Amplifier Type: INSTRUMENTATION AMPLIFIER; Supplier 1: Digi-Key; Manufacturer Part Number: AD620BRZ-R7; RoHS: Yes; Category: Amplifiers - Op Amps, Buffer, Instrumentation; Stock 1: 7220; Pricing 1: 1=17,47000, 10=16,06000, 25=15,39400, 100=13,56320, 250=12,95248 (USD); Mount: Surface Mount; Case/Package: SOIC; Number of Pins: 8; Contact Plating: Tin,Matte; Min Operating Temperature: -55°C; Max Operating Temperature: 125°C; Max Dual Supply Voltage: 18V; Packaging: Tape and Reel; Package Quantity: 1; Number of Circuits: 1; Number of Elements: 1; Power Dissipation: 650mW; Nominal Supply Current: 1.3mA; Operating Supply Voltage: 18V; Series: -; Radiation Hardening: No; Lead Free: Contains Lead; RoHS Compliant: Yes; ComponentLink1URL: https://datasheet.ciiva.com/26850/ad620brz-r7-26850017.pdf?src-supplier=IIIC; ComponentLink1Description: https://datasheet.ciiva.com/26850/ad620brz-r7-26850017.pdf?src-supplier=IIIC; ComponentLink2URL: https://datasheet.ciiva.com/2976/ad620-2976642.pdf?src-supplier=Avnet; ComponentLink2Description: https://datasheet.ciiva.com/2976/ad620-2976642.pdf?src-supplier=Avnet; ComponentLink3URL: https://datasheet.ciiva.com/17373/ad620-17373991.pdf?src-supplier=Avnet+Europe; ComponentLink3Description: https://datasheet.ciiva.com/17373/ad620-17373991.pdf?src-supplier=Avnet+Europe; Supplier Part Number 1: AD620BRZ-R7CT-ND